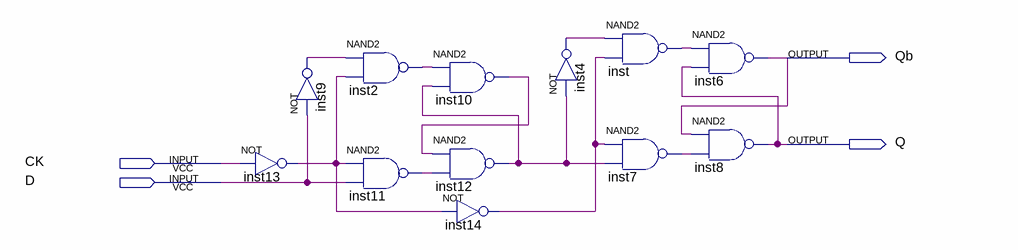
[diagram p0: schematic sheet]
// Quartus schematic cus_dff.bdf as structural Verilog: 12 symbols, 4 pins
module cus_dff (
  input  CK,
  input  D,
  output Qb,
  output Q
);

  wire inst2_out, inst4_out, inst7_out, inst9_out, inst10_out, inst11_out, inst12_out, inst13_out,
       inst14_out, inst_out;

  not inst9 (inst9_out, D);
  not inst13 (inst13_out, CK);
  nand inst2 (inst2_out, inst9_out, inst13_out);
  nand inst11 (inst11_out, inst13_out, D);
  nand inst10 (inst10_out, inst2_out, inst12_out);
  nand inst12 (inst12_out, inst10_out, inst11_out);
  not inst14 (inst14_out, inst13_out);
  not inst4 (inst4_out, inst12_out);
  nand inst (inst_out, inst4_out, inst14_out);
  nand inst7 (inst7_out, inst14_out, inst12_out);
  nand inst6 (Qb, inst_out, Q);
  nand inst8 (Q, Qb, inst7_out);
endmodule
